# Altium schematic sheet Zynq DDR Interface & Termination.SchDoc
size A3; SheetNumber: 7; SheetTotal: 11
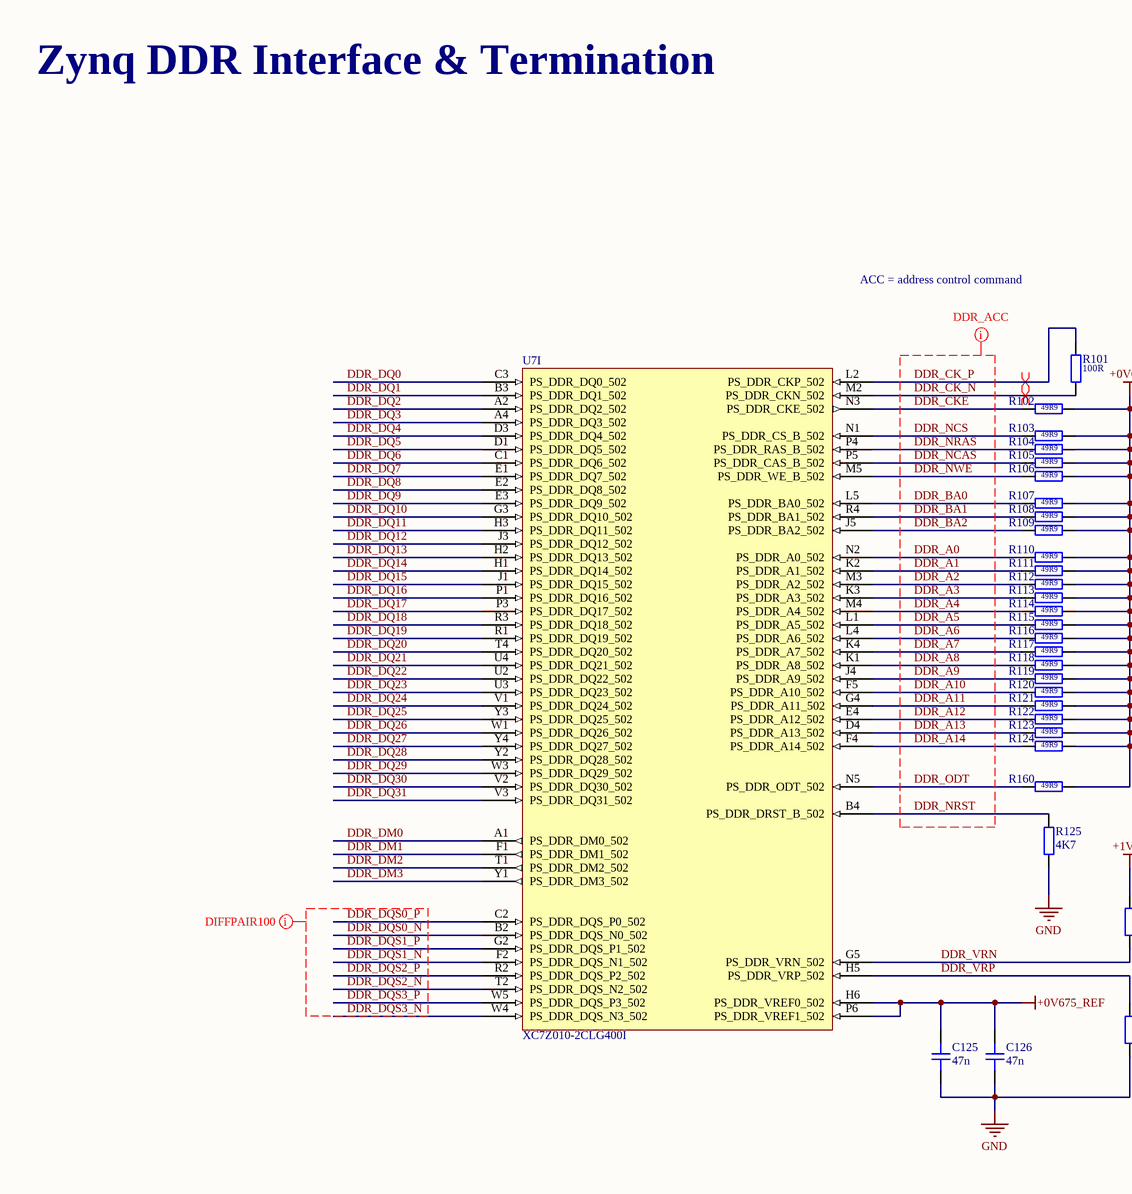
[diagram p0: Zynq DDR Interface & Termination.SchDoc, left]
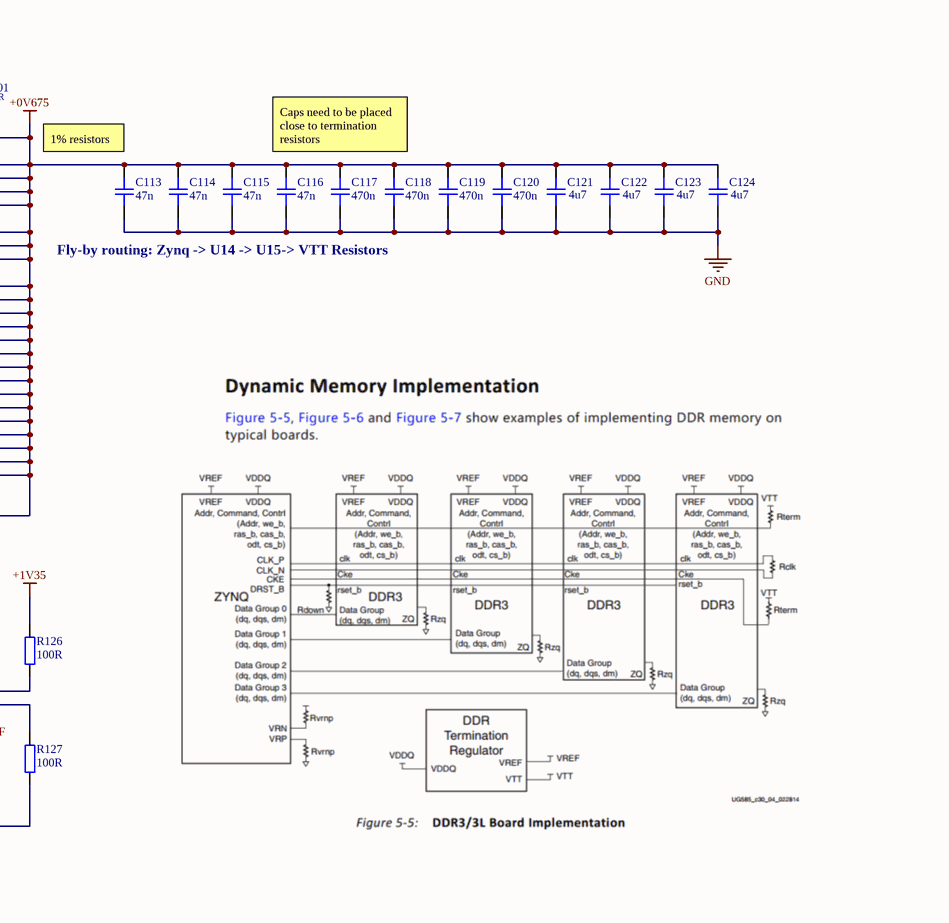
[diagram p1: Zynq DDR Interface & Termination.SchDoc, middle]

## Parts
C113  value 47n  [CAP_0201]  (hidden comment: C0201)
C114  value 47n  [CAP_0201]  (hidden comment: C0201)
C115  value 47n  [CAP_0201]  (hidden comment: C0201)
C116  value 47n  [CAP_0201]  (hidden comment: C0201)
C117  value 470n  [CAP_0201]  (hidden comment: C0201)
C118  value 470n  [CAP_0201]  (hidden comment: C0201)
C119  value 470n  [CAP_0201]  (hidden comment: C0201)
C120  value 470n  [CAP_0201]  (hidden comment: C0201)
C121  value 4u7  [CAP_0402]  (hidden comment: C0402)
C122  value 4u7  [CAP_0402]  (hidden comment: C0402)
C123  value 4u7  [CAP_0402]  (hidden comment: C0402)
C124  value 4u7  [CAP_0402]  (hidden comment: C0402)
C125  value 47n  [CAP_0201]  (hidden comment: C0201)
C126  value 47n  [CAP_0201]  (hidden comment: C0201)
R101  value 100R  [RES_0201]  (hidden comment: R0201)
R102  value 49R9  [RES_0201]  (hidden comment: R0201)
R103  value 49R9  [RES_0201]  (hidden comment: R0201)
R104  value 49R9  [RES_0201]  (hidden comment: R0201)
R105  value 49R9  [RES_0201]  (hidden comment: R0201)
R106  value 49R9  [RES_0201]  (hidden comment: R0201)
R107  value 49R9  [RES_0201]  (hidden comment: R0201)
R108  value 49R9  [RES_0201]  (hidden comment: R0201)
R109  value 49R9  [RES_0201]  (hidden comment: R0201)
R110  value 49R9  [RES_0201]  (hidden comment: R0201)
R111  value 49R9  [RES_0201]  (hidden comment: R0201)
R112  value 49R9  [RES_0201]  (hidden comment: R0201)
R113  value 49R9  [RES_0201]  (hidden comment: R0201)
R114  value 49R9  [RES_0201]  (hidden comment: R0201)
R115  value 49R9  [RES_0201]  (hidden comment: R0201)
R116  value 49R9  [RES_0201]  (hidden comment: R0201)
R117  value 49R9  [RES_0201]  (hidden comment: R0201)
R118  value 49R9  [RES_0201]  (hidden comment: R0201)
R119  value 49R9  [RES_0201]  (hidden comment: R0201)
R120  value 49R9  [RES_0201]  (hidden comment: R0201)
R121  value 49R9  [RES_0201]  (hidden comment: R0201)
R122  value 49R9  [RES_0201]  (hidden comment: R0201)
R123  value 49R9  [RES_0201]  (hidden comment: R0201)
R124  value 49R9  [RES_0201]  (hidden comment: R0201)
R125  value 4K7  [RES_0402]  (hidden comment: R0402)
R126  value 100R  [RES_0402]  (hidden comment: R0402)
R127  value 100R  [RES_0402]  (hidden comment: R0402)
R160  value 49R9  [RES_0201]  (hidden comment: R0201)
U7  XC7Z010-2CLG400I  [BGA400C80P20X20_1700X1700X160N]  (part I of 9)

## Nets
+0V675: C113.2 C114.2 C115.2 C116.2 C117.2 C118.2 C119.2 C120.2 C121.2 C122.2 C123.2 C124.2 R102.2 R103.2 R104.2 R105.2 R106.2 R107.2 R108.2 R109.2 R110.2 R111.2 R112.2 R113.2 R114.2 R115.2 R116.2 R117.2 R118.2 R119.2 R120.2 R121.2 R122.2 R123.2 R124.2 R160.2
+0V675_REF: C125.2 C126.2 U7.H6(PS_DDR_VREF0_502) U7.P6(PS_DDR_VREF1_502)
+1V35: R126.1
GND: C113.1 C114.1 C115.1 C116.1 C117.1 C118.1 C119.1 C120.1 C121.1 C122.1 C123.1 C124.1 C125.1 C126.1 R125.2 R127.2
DDR_A0: R110.1 U7.N2(PS_DDR_A0_502)
DDR_A1: R111.1 U7.K2(PS_DDR_A1_502)
DDR_A2: R112.1 U7.M3(PS_DDR_A2_502)
DDR_A3: R113.1 U7.K3(PS_DDR_A3_502)
DDR_A4: R114.1 U7.M4(PS_DDR_A4_502)
DDR_A5: R115.1 U7.L1(PS_DDR_A5_502)
DDR_A6: R116.1 U7.L4(PS_DDR_A6_502)
DDR_A7: R117.1 U7.K4(PS_DDR_A7_502)
DDR_A8: R118.1 U7.K1(PS_DDR_A8_502)
DDR_A9: R119.1 U7.J4(PS_DDR_A9_502)
DDR_A10: R120.1 U7.F5(PS_DDR_A10_502)
DDR_A11: R121.1 U7.G4(PS_DDR_A11_502)
DDR_A12: R122.1 U7.E4(PS_DDR_A12_502)
DDR_A13: R123.1 U7.D4(PS_DDR_A13_502)
DDR_A14: R124.1 U7.F4(PS_DDR_A14_502)
DDR_BA0: R107.1 U7.L5(PS_DDR_BA0_502)
DDR_BA1: R108.1 U7.R4(PS_DDR_BA1_502)
DDR_BA2: R109.1 U7.J5(PS_DDR_BA2_502)
DDR_CK_N: R101.1 U7.M2(PS_DDR_CKN_502)
DDR_CK_P: R101.2 U7.L2(PS_DDR_CKP_502)
DDR_CKE: R102.1 U7.N3(PS_DDR_CKE_502)
DDR_DM0: U7.A1(PS_DDR_DM0_502)
DDR_DM1: U7.F1(PS_DDR_DM1_502)
DDR_DM2: U7.T1(PS_DDR_DM2_502)
DDR_DM3: U7.Y1(PS_DDR_DM3_502)
DDR_DQ0: U7.C3(PS_DDR_DQ0_502)
DDR_DQ1: U7.B3(PS_DDR_DQ1_502)
DDR_DQ2: U7.A2(PS_DDR_DQ2_502)
DDR_DQ3: U7.A4(PS_DDR_DQ3_502)
DDR_DQ4: U7.D3(PS_DDR_DQ4_502)
DDR_DQ5: U7.D1(PS_DDR_DQ5_502)
DDR_DQ6: U7.C1(PS_DDR_DQ6_502)
DDR_DQ7: U7.E1(PS_DDR_DQ7_502)
DDR_DQ8: U7.E2(PS_DDR_DQ8_502)
DDR_DQ9: U7.E3(PS_DDR_DQ9_502)
DDR_DQ10: U7.G3(PS_DDR_DQ10_502)
DDR_DQ11: U7.H3(PS_DDR_DQ11_502)
DDR_DQ12: U7.J3(PS_DDR_DQ12_502)
DDR_DQ13: U7.H2(PS_DDR_DQ13_502)
DDR_DQ14: U7.H1(PS_DDR_DQ14_502)
DDR_DQ15: U7.J1(PS_DDR_DQ15_502)
DDR_DQ16: U7.P1(PS_DDR_DQ16_502)
DDR_DQ17: U7.P3(PS_DDR_DQ17_502)
DDR_DQ18: U7.R3(PS_DDR_DQ18_502)
DDR_DQ19: U7.R1(PS_DDR_DQ19_502)
DDR_DQ20: U7.T4(PS_DDR_DQ20_502)
DDR_DQ21: U7.U4(PS_DDR_DQ21_502)
DDR_DQ22: U7.U2(PS_DDR_DQ22_502)
DDR_DQ23: U7.U3(PS_DDR_DQ23_502)
DDR_DQ24: U7.V1(PS_DDR_DQ24_502)
DDR_DQ25: U7.Y3(PS_DDR_DQ25_502)
DDR_DQ26: U7.W1(PS_DDR_DQ26_502)
DDR_DQ27: U7.Y4(PS_DDR_DQ27_502)
DDR_DQ28: U7.Y2(PS_DDR_DQ28_502)
DDR_DQ29: U7.W3(PS_DDR_DQ29_502)
DDR_DQ30: U7.V2(PS_DDR_DQ30_502)
DDR_DQ31: U7.V3(PS_DDR_DQ31_502)
DDR_DQS0_N: U7.B2(PS_DDR_DQS_N0_502)
DDR_DQS0_P: U7.C2(PS_DDR_DQS_P0_502)
DDR_DQS1_N: U7.F2(PS_DDR_DQS_N1_502)
DDR_DQS1_P: U7.G2(PS_DDR_DQS_P1_502)
DDR_DQS2_N: U7.T2(PS_DDR_DQS_N2_502)
DDR_DQS2_P: U7.R2(PS_DDR_DQS_P2_502)
DDR_DQS3_N: U7.W4(PS_DDR_DQS_N3_502)
DDR_DQS3_P: U7.W5(PS_DDR_DQS_P3_502)
DDR_NCAS: R105.1 U7.P5(PS_DDR_CAS_B_502)
DDR_NCS: R103.1 U7.N1(PS_DDR_CS_B_502)
DDR_NRAS: R104.1 U7.P4(PS_DDR_RAS_B_502)
DDR_NRST: R125.1 U7.B4(PS_DDR_DRST_B_502)
DDR_NWE: R106.1 U7.M5(PS_DDR_WE_B_502)
DDR_ODT: R160.1 U7.N5(PS_DDR_ODT_502)
DDR_VRN: R126.2 U7.G5(PS_DDR_VRN_502)
DDR_VRP: R127.1 U7.H5(PS_DDR_VRP_502)

## Layout directives
net class DDR_ACC: DDR_A0, DDR_A1, DDR_A2, DDR_A3, DDR_A4, DDR_A5, DDR_A6, DDR_A7, DDR_A8, DDR_A9, DDR_A10, DDR_A11, DDR_A12, DDR_A13, DDR_A14, DDR_BA0, DDR_BA1, DDR_BA2, DDR_CK_N, DDR_CK_P, DDR_CKE, DDR_NCAS, DDR_NCS, DDR_NRAS, DDR_NRST, DDR_NWE, DDR_ODT
differential pair; differential pair class 100ohm: DDR_CK_N, DDR_CK_P, DDR_DQS0_N, DDR_DQS0_P, DDR_DQS1_N, DDR_DQS1_P, DDR_DQS2_N, DDR_DQS2_P, DDR_DQS3_N, DDR_DQS3_P

## Notes on the sheet
- Zynq DDR Interface & Termination
- ACC = address control command
- (near C113) 1% resistors
- Caps need to be placed close to termination resistors
- Fly-by routing: Zynq -> U14 -> U15-> VTT Resistors

## Library data of the parts
C113-C120 C125 C126 = CAP_0201: Capacitor SMD 0201; Rating: 16V; Manufacturer: *; Manufacturer Part Number: *; Distributor Link: *; LCSC: *; Dielectric: *
C121-C124 = CAP_0402: Capacitor SMD 0402; Manufacturer: *; Manufacturer Part Number: *; Distributor Link: *; LCSC: *; Rating: *; Dielectric: *
R101-R124 R160 = RES_0201: Resistor SMD 0201; Manufacturer: *; Manufacturer Part Number: *; Distributor Link: *; LCSC: *
R125-R127 = RES_0402: Resistor SMD 0402; Manufacturer: *; Manufacturer Part Number: *; Distributor Link: *; LCSC: *